# Altium project PressurePulse_Brain-PCB.PrjPcb (part 2 of 2)
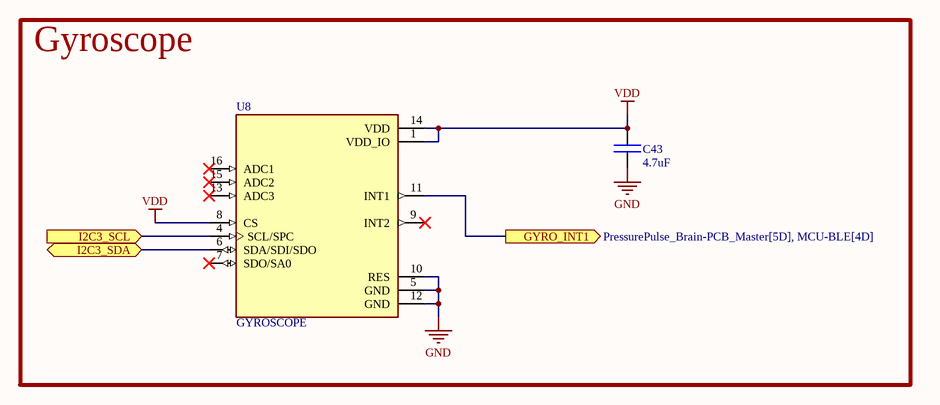
[diagram p17: Gyroscope.SchDoc]

## Nets that join several sheets
+5: Flow-Sensor (J10.8), Boost (6 pins), Magnetic-Charger (D36.K J12.1)
GND: MCU-BLE (37 pins), SWD (6 pins), USB-Socket (5 pins), Pressure-Sensor (6 pins), Flow-Sensor (7 pins), PWR-Switch (19 pins), Fuel-Gauge (5 pins), LDO (5 pins), Boost (6 pins), Magnetic-Charger (D36.A Q11.S R62.1), SD-Socket (13 pins), TFT-Display (9 pins), Amplifier (13 pins), Rotary-Encoder (5 pins), Tacile-Buttons (SW3.3 SW4.3 SW5.3), Gyroscope (C43.1 U8.5 U8.10 U8.12)
VBATT: Fuel-Gauge (R16.2 TP8.1 U3.7), LDO (C8.2 U4.4 U4.6), Boost (Q1.S R21.2), TFT-Display (D28.K J11.1), Amplifier (5 pins)
VDD: MCU-BLE (24 pins), SWD (D6.K J5.1), Pressure-Sensor (D21.K J9.2), PWR-Switch (6 pins), Fuel-Gauge (R17.2 R18.2), LDO (5 pins), SD-Socket (7 pins), TFT-Display (R57.2 R58.2 R59.2), Amplifier (Q7.S R47.2 R48.2), Rotary-Encoder (R63.2 R65.2), Gyroscope (C43.2 U8.1 U8.8 U8.14)
BATT_DETECT: MCU-BLE (U6.67), Fuel-Gauge (R18.1 R19.2 TP9.1 U3.10)
FLOW_SIG: MCU-BLE (R70.1), Flow-Sensor (D24.K J10.1 TP32.1)
GAUGE_IO: MCU-BLE (U6.66), Fuel-Gauge (R17.1 TP10.1 U3.12)
I2C3_SCL: MCU-BLE (R40.1 TP15.1 U6.9), Pressure-Sensor (D20.K J9.5), Flow-Sensor (D26.K J10.5), Fuel-Gauge (U3.2), Gyroscope (U8.4)
I2C3_SDA: MCU-BLE (R41.1 TP16.1 U6.10), Pressure-Sensor (D23.K J9.4), Flow-Sensor (D27.K J10.6), Fuel-Gauge (U3.1), Gyroscope (U8.6)
NetD22_K: MCU-BLE (U6.64), Pressure-Sensor (D22.K J9.1)
NetD34_K: MCU-BLE (U6.25), TFT-Display (D34.K J11.9)
NetD35_K: MCU-BLE (U6.18), TFT-Display (D35.K J11.4)
NetJ12_2: MCU-BLE (U6.2), Magnetic-Charger (J12.2)
NetQ6_G: MCU-BLE (U6.38), Amplifier (Q6.G)
NetQ7_G: MCU-BLE (U6.39), Amplifier (Q7.G)
NetQ8_G: MCU-BLE (U6.48), Amplifier (Q8.G)
NetQ9_G: MCU-BLE (U6.40), Amplifier (Q9.G)
NetR22_2: MCU-BLE (U6.65), Boost (R22.2)
NetR61_2: MCU-BLE (U6.51), Magnetic-Charger (R61.2)
NetR67_2: MCU-BLE (U6.50), Amplifier (R67.2)
NetSW3_1: MCU-BLE (U6.58), Tacile-Buttons (SW3.1)
NetSW4_1: MCU-BLE (U6.59), Tacile-Buttons (SW4.1)
NetSW5_1: MCU-BLE (U6.60), Tacile-Buttons (SW5.1)
NetU6_17: MCU-BLE (U6.17), Gyroscope (U8.11)
nRST: MCU-BLE (U6.8), SWD (D7.K R44.1 TP21.1)
PWR_SWT_STAT: MCU-BLE (U6.61), PWR-Switch (R1.2 R3.1 TP6.1 U1.9)
ROT_SWT_OUT: MCU-BLE (U6.57), Rotary-Encoder (SW2.SW1 TP41.1)
ROT_TIM1_CH1: MCU-BLE (U6.24), Rotary-Encoder (C36.2 R64.2 TP39.1)
ROT_TIM1_CH2: MCU-BLE (U6.23), Rotary-Encoder (C37.2 R66.2 TP40.1)
SAI1A_CLK: MCU-BLE (U6.47), Amplifier (TP22.1 U7.16)
SAI1A_DATA: MCU-BLE (U6.49), Amplifier (TP23.1 U7.1)
SAI1A_FS: MCU-BLE (U6.46), Amplifier (TP24.1 U7.14)
SD_CARD_DETECT: MCU-BLE (U6.6), SD-Socket (5 pins)
SPI1_CLK: MCU-BLE (U6.20), TFT-Display (R60.1 TP36.1)
SPI1_MISO: MCU-BLE (U6.21), TFT-Display (D30.K J11.6 R57.1 TP35.1)
SPI1_MOSI: MCU-BLE (U6.22), TFT-Display (D31.K J11.7 R58.1 TP34.1)
SPI1_NSS: MCU-BLE (U6.19), TFT-Display (D32.K J11.8 R59.1 TP37.1)
SPI2_CLK: MCU-BLE (U6.62), SD-Socket (R54.1 TP27.1)
SPI2_MISO: MCU-BLE (U6.11), SD-Socket (D13.K J7.7 R51.1 TP26.1)
SPI2_MOSI: MCU-BLE (U6.12), SD-Socket (D14.K J7.3 R52.1 TP25.1)
SPI2_NSS: MCU-BLE (U6.7), SD-Socket (D12.K J7.2 R50.1 TP29.1)
SWD_CLK: MCU-BLE (U6.56), SWD (D9.K R45.2 TP18.1)
SWD_IO: MCU-BLE (U6.54), SWD (D10.K R43.2 TP19.1)
SWO: MCU-BLE (U6.63), SWD (D8.K R46.2 TP20.1)
TEMP_SIG: MCU-BLE (R71.1), Flow-Sensor (D25.K J10.3 TP33.1)
TFT_WAIT: MCU-BLE (U6.26), TFT-Display (D33.K J11.10 TP38.1)
USB_D_N: MCU-BLE (U6.52), USB-Socket (D18.K J8.2 TP30.1)
USB_D_P: MCU-BLE (U6.53), USB-Socket (D17.K J8.3 TP31.1)
VBATT_SWT: PWR-Switch (5 pins), Fuel-Gauge (C7.2 R16.1 U3.6 U3.8)